# EasyEDA Pro project Master Design File.epro, board PCB1
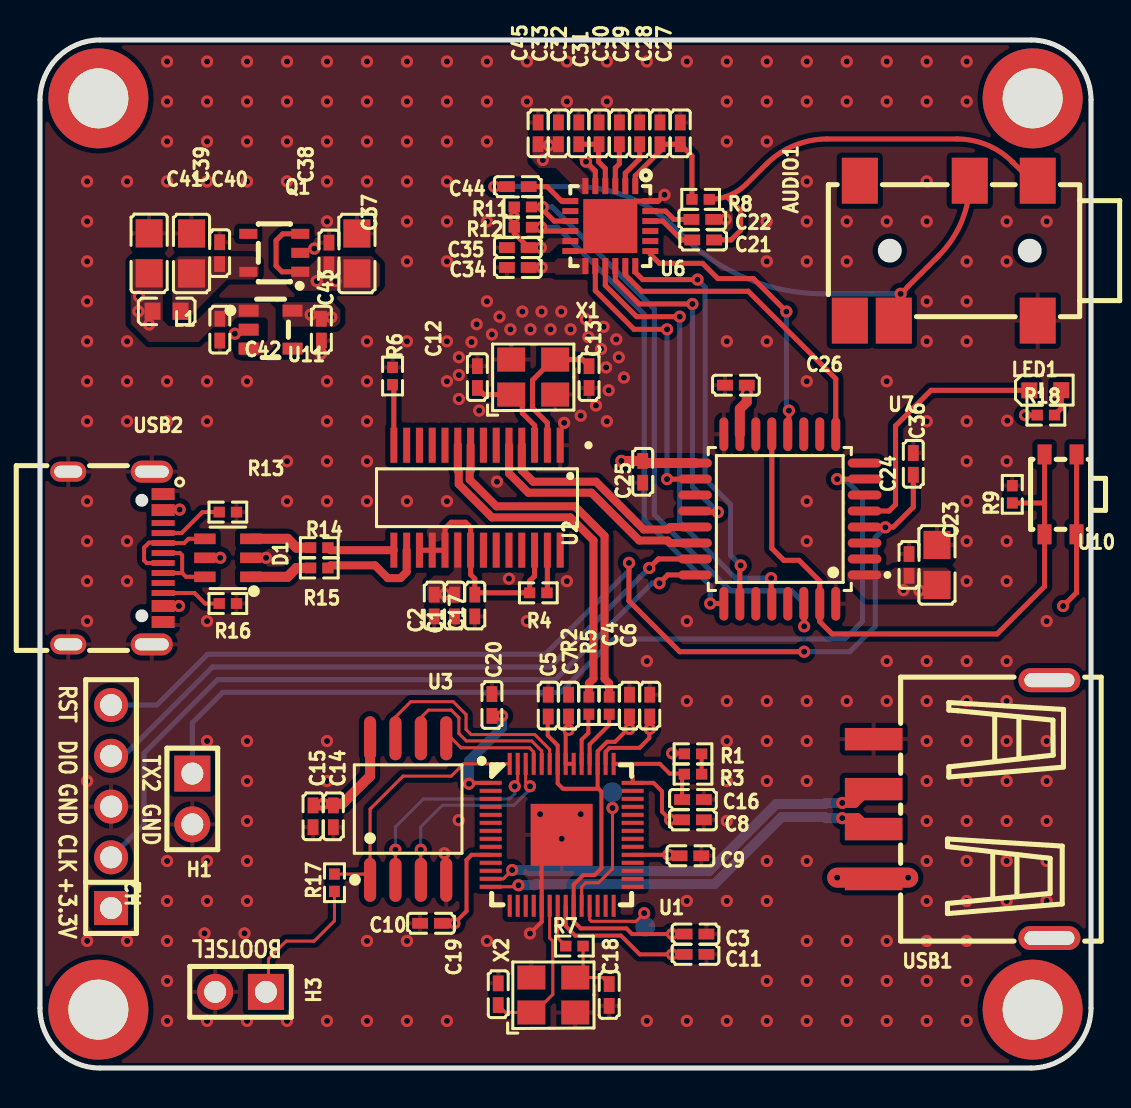
[diagram p2: board, top side]
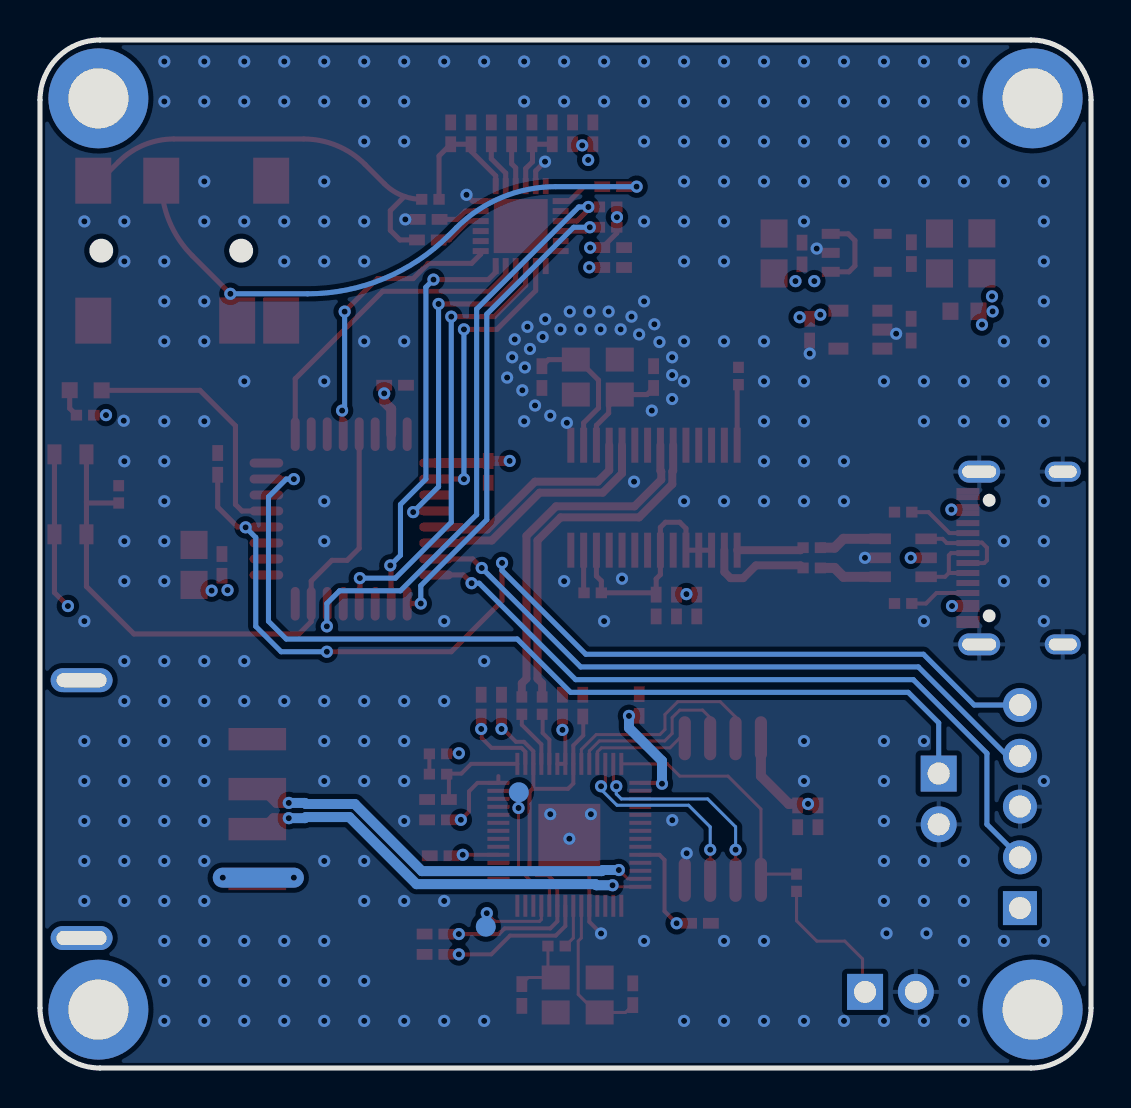
[diagram p3: board, bottom side, seen from below]

Outline 52.58 x 51.44 mm; copper layers: Top Layer, GND, PWR, Bottom Layer. Coordinates in mm from the lower left corner of the outline.
Outline path: 0,48.44 0,3 arc(0.88,0.88) 3,0 49.58,0 arc(51.7,0.88) 52.58,3 52.58,48.44 arc(51.7,50.56) 49.58,51.44 3,51.44 arc(0.88,50.56) 0,48.44
Stack: Top Layer 0.035mm Outer layer thickness 1oz / Dielectric1 0.2104mm 7628 RC49% 8.6mil / GND 0.0152mm Inner layer thickness / Dielectric2 1.065mm 1.1mm H/HOZ Copper / PWR 0.0152mm Inner layer thickness / Dielectric3 0.2104mm 7628 RC49% 8.6mil / Bottom Layer 0.035mm Outer layer thickness 1oz

## Design rules (mm)
template: Custom Config
spacing copperThickness1oz (default): track to track 0.102, other pairs 0.152 to 0.3
spacing copperThickness2oz: track to track 0.203, other pairs 0.152 to 0.3
track width copperThickness1oz (default): min 0.127, default 0.254, max 2.54
track width copperThickness2oz: min 0.203, default 0.254, max 2.54
differential pair differentialPair (default): width min 0.127, default 0.254, max 2.54; gap min 0.152, default 0.152
via viaSize (default): diameter min 0.5, default 0.61, max 10; hole min 0.3, default 0.305, max 6.3

## Placement (name value [footprint] x y rotation side)
AUDIO1  PJ-3420-A-SMT  [AUDIO-SMD_PJ-3420-A-SMT_C319102]  45.21 40.89 180 top
C1  100nF  [C0402]  20.74 23.14 90 top
C2  10uF  [C0402]  19.72 23.14 90 top
C3  100nF  [C0402]  32.79 6.7 180 top
C4  100nF  [C0402]  29.49 18.13 270 top
C5  2.2uF  [C0402]  25.43 18.13 270 top
C6  2.2uF  [C0402]  30.51 18.13 270 top
C7  100nF  [C0402]  26.44 18.13 270 top
C8  100nF  [C0402]  32.67 12.42 180 top
C9  100nF  [C0402]  32.54 10.62 180 top
C10  100nF  [C0402]  19.56 7.24 0 top
C11  100nF  [C0402]  32.79 5.69 180 top
C12  15pF  [C0402]  21.88 34.57 90 top
C13  15pF  [C0402]  27.47 34.57 90 top
C14  2.2uF  [C0402]  14.68 12.59 90 top
C15  100nF  [C0402]  13.66 12.59 90 top
C16  2.2uF  [C0402]  32.67 13.43 180 top
C17  10uF  [C0402]  21.75 23.14 90 top
C18  15pF  [C0402]  28.47 3.65 270 top
C19  15pF  [C0402]  22.92 3.69 270 top
C20  100nF  [C0402]  22.61 18.16 270 top
C21  1uF  [C0402]  33.17 41.43 0 top
C22  1uF  [C0402]  33.13 42.46 0 top
C23  10uF  [C0805]  44.87 25.17 270 top
C24  100nF  [C0402]  43.47 25.17 270 top
C25  100nF  [C0402]  30.15 29.83 90 top
C26  100nF  [C0402]  34.81 34.16 0 top
C27  1uF  [C0402]  32.03 46.76 270 top
C28  1uF  [C0402]  31.02 46.76 270 top
C29  1uF  [C0402]  30 46.76 270 top
C30  1uF  [C0402]  28.98 46.76 270 top
C31  1uF  [C0402]  27.97 46.76 270 top
C32  1uF  [C0402]  26.95 46.76 270 top
C33  100nF  [C0402]  25.94 46.76 270 top
C34  1uF  [C0402]  23.9 40.05 0 top
C35  1uF  [C0402]  23.9 41.05 0 top
C36  100nF  [C0402]  43.69 30.23 270 top
C37  10uF  [C0805]  15.85 40.75 270 top
C38  100nF  [C0402]  14.46 40.75 270 top
C39  100nF  [C0402]  8.99 40.77 270 top
C40  10uF  [C0805]  7.58 40.75 270 top
C41  10uF  [C0805]  5.46 40.76 270 top
C42  100nF  [C0402]  9 36.94 90 top
C43  100nF  [C0402]  14.08 36.94 90 top
C44  10uF  [C0402]  23.9 44.1 180 top
C45  10uF  [C0402]  24.92 46.76 270 top
D1  USBLC6-2SC6  [SOT-23-6_L2.9-W1.6-P0.95-LS2.8-BL]  9.4 25.53 90 top
H1  -  [HDR-TH_2P-P2.54-V-M-1]  7.62 13.46 270 top
H2  -  [HDR-TH_5P-P2.54-V-M]  3.56 13.08 90 top
H3  -  [HDR-TH_2P-P2.54-V-M-1]  10.03 3.81 180 top
L1  MPZ1608S101ATAH0  [L0603]  6.33 37.86 180 top
LED1  XL-1608UGC-04  [LED0603-RD_GREEN]  50.29 33.91 0 top
NOREF  -  [Pad_e84]  49.66 2.92 0 top
NOREF#2  -  [Pad_e86]  49.66 48.51 0 top
NOREF#3  -  [Pad_e89]  2.92 2.92 0 top
NOREF#4  -  [Pad_e90]  2.92 48.51 0 top
Q1  XC6220B331MR-G  [SOT-25_L3.0-W1.6-P0.95-LS2.8-TL]  11.72 40.78 180 top
R1  200Ω  [R0402]  32.67 15.72 0 top
R2  27Ω  [R0402]  27.46 18.13 90 top
R3  1Ω  [R0402]  32.67 14.7 0 top
R4  NC  [R0402]  24.93 23.77 0 top
R5  27Ω  [R0402]  28.47 18.13 90 top
R6  2.7kΩ  [R0402]  17.64 34.62 270 top
R7  1kΩ  [R0402]  26.73 6.1 180 top
R8  1.5kΩ  [R0402]  33.05 43.46 0 top
R9  1.5kΩ  [R0402]  48.64 28.7 90 top
R11  1.5kΩ  [R0402]  24.16 43.08 0 top
R12  1.5kΩ  [R0402]  24.16 42.06 0 top
R13  5.1kΩ  [R0402]  9.4 27.81 0 top
R14  0Ω  [R0402]  13.97 26.03 180 top
R15  0Ω  [R0402]  13.97 25.02 180 top
R16  5.1kΩ  [R0402]  9.4 23.24 0 top
R17  1kΩ  [R0402]  14.73 9.27 90 top
R18  150Ω  [R0402]  50.32 32.67 180 top
U1  RP2040  [LQFN-56_L7.0-W7.0-P0.4-EP]  26.1 11.67 0 top
U2  FE1.1S-BSOP28BCN  [SSOP-28_L9.9-W3.9-P0.64-LS6.0-BL-1]  21.86 28.53 180 top
U3  W25Q128JVSIQ  [SOP-8_L5.3-W5.3-P1.27-LS8.0-BL]  18.42 12.96 0 top
U4  -  [test pad 1]  28.63 13.8 180 bottom
U5  -  [test pad 1]  30.28 7.07 180 bottom
U6  MAX9860ETG+T  [TQFN-24_L4.0-W4.0-P0.50-BL-EP]  28.53 42.12 180 top
U7  STM32G431K6T6  [LQFP-32_L7.0-W7.0-P0.80-LS9.0-BL]  37.01 27.47 90 top
U10  TSC4A 160gf-WZ 016  [KEY-SMD_TSC4A]  51.05 28.7 90 top
U11  XC6220B181MR  [SOT-23-5_L2.9-W1.6-P0.95-LS2.8-BR]  11.54 36.94 180 top
USB1  10.0 QHHTZB6.3  [USB-A-TH_10.0QHHTZB6.3]  46.1 12.95 90 top
USB2  USB-310-B-SU  [USB-C-SMD_20P-P0.50-L7.4-W8.9]  3.79 25.52 90 top
X1  12MHz  [OSC-SMD_4P-L3.2-W2.5-BL]  24.67 34.57 0 top
X2  12MHz  [OSC-SMD_4P-L3.2-W2.5-BL]  25.68 3.65 0 top

## Footprints (pads in the part's own frame, mm; a bottom-side part is the same pattern mirrored in y, then rotated)
AUDIO-SMD_PJ-3420-A-SMT_C319102
  rect 1.8x2.3 smd: 1(-4.7,-3.5) 2(-4.7,3.5) 3(-1.3,-3.5) 4(2.5,3.5) 5(4.7,3.5) 6(4.2,-3.5)
C0402
  rect 0.79x0.54 smd: 1(-0.545,0) 2(0.545,0)
C0805
  rect 1.41x1.35 smd: 1(-1,0) 2(1,0)
HDR-TH_2P-P2.54-V-M-1
  rect 1.8x1.8 hole 1.1: 1(-1.27,0)
  round 1.8 hole 1.1: 2(1.27,0)
HDR-TH_5P-P2.54-V-M
  rect 1.7x1.7 hole 1.1: 1(-5.08,0)
  round 1.7 hole 1.1: 2(-2.54,0) 3(0,0) 4(2.54,0) 5(5.08,0)
KEY-SMD_TSC4A
  rect 1x0.7 smd: 1(-2,0.8) 2(2,0.8) 3(-2,-0.8) 4(2,-0.8)
L0603
  rect 0.8x0.864 smd: 1(-0.7,0) 2(0.7,0)
LED0603-RD_GREEN
  rect 0.8x0.8 smd: 1(-0.799,-0.004) 2(0.799,0.004)
LQFN-56_L7.0-W7.0-P0.4-EP
  rect 1.1x0.2 smd: 1(-3.55,2.6) 2(-3.55,2.2) 3(-3.55,1.8) 4(-3.55,1.4) 5(-3.55,1) 6(-3.55,0.6) 7(-3.55,0.2) 8(-3.55,-0.2) 9(-3.55,-0.6) 10(-3.55,-1) 11(-3.55,-1.4) 12(-3.55,-1.8) 13(-3.55,-2.2) 14(-3.55,-2.6) 29(3.55,-2.6) 30(3.55,-2.2) 31(3.55,-1.8) 32(3.55,-1.4) 33(3.55,-1) 34(3.55,-0.6) 35(3.55,-0.2) 36(3.55,0.2) 37(3.55,0.6) 38(3.55,1) 39(3.55,1.4) 40(3.55,1.8) 41(3.55,2.2) 42(3.55,2.6)
  rect 0.2x1.1 smd: 15(-2.6,-3.55) 16(-2.2,-3.55) 17(-1.8,-3.55) 18(-1.4,-3.55) 19(-1,-3.55) 20(-0.6,-3.55) 21(-0.2,-3.55) 22(0.2,-3.55) 23(0.6,-3.55) 24(1,-3.55) 25(1.4,-3.55) 26(1.8,-3.55) 27(2.2,-3.55) 28(2.6,-3.55) 43(2.6,3.55) 44(2.2,3.55) 45(1.8,3.55) 46(1.4,3.55) 47(1,3.55) 48(0.6,3.55) 49(0.2,3.55) 50(-0.2,3.55) 51(-0.6,3.55) 52(-1,3.55) 53(-1.4,3.55) 54(-1.8,3.55) 55(-2.2,3.55) 56(-2.6,3.55)
  rect 3.1x3.1 smd: 57(0,0)
LQFP-32_L7.0-W7.0-P0.80-LS9.0-BL
  oval 0.448x1.684 smd: 1(-2.8,-4.242) 2(-2,-4.242) 3(-1.2,-4.242) 4(-0.4,-4.242) 5(0.4,-4.242) 6(1.2,-4.242) 7(2,-4.242) 8(2.8,-4.242) 17(2.8,4.242) 18(2,4.242) 19(1.2,4.242) 20(0.4,4.242) 21(-0.4,4.242) 22(-1.2,4.242) 23(-2,4.242) 24(-2.8,4.242)
  oval 1.684x0.448 smd: 9(4.242,-2.8) 10(4.242,-2) 11(4.242,-1.2) 12(4.242,-0.4) 13(4.242,0.4) 14(4.242,1.2) 15(4.242,2) 16(4.242,2.8) 25(-4.242,2.8) 26(-4.242,2) 27(-4.242,1.2) 28(-4.242,0.4) 29(-4.242,-0.4) 30(-4.242,-1.2) 31(-4.242,-2) 32(-4.242,-2.8)
OSC-SMD_4P-L3.2-W2.5-BL
  rect 1.4x1.2 smd: 1(-1.1,-0.875) 2(1.1,-0.875) 3(1.1,0.875) 4(-1.1,0.875)
Pad_e84
  round 5 hole 3: 1(0,0)
Pad_e86
  round 5 hole 3: 1(0,0)
Pad_e89
  round 5 hole 3: 1(0,0)
Pad_e90
  round 5 hole 3: 1(0,0)
R0402
  rect 0.566x0.54 smd: 1(-0.433,0) 2(0.433,0)
SOP-8_L5.3-W5.3-P1.27-LS8.0-BL
  oval 0.609x2.204 smd: 1(-1.905,-3.542) 2(-0.635,-3.542) 3(0.635,-3.542) 4(1.905,-3.542) 5(1.905,3.542) 6(0.635,3.542) 7(-0.635,3.542) 8(-1.905,3.542)
SOT-23-5_L2.9-W1.6-P0.95-LS2.8-BR
  rect 1x0.6 smd: 1(1.1,-0.95) 2(1.1,0) 3(1.1,0.95) 4(-1.1,0.95) 5(-1.1,-0.95)
SOT-23-6_L2.9-W1.6-P0.95-LS2.8-BL
  rect 0.532x1.072 smd: 1(-0.95,-1.149) 2(0,-1.149) 3(0.95,-1.149) 4(0.95,1.149) 5(0,1.149) 6(-0.95,1.149)
SOT-25_L3.0-W1.6-P0.95-LS2.8-TL
  rect 0.9x0.5 smd: 1(-1.3,0.95) 2(-1.3,0) 3(-1.3,-0.95) 4(1.3,-0.95) 5(1.3,0.95)
SSOP-28_L9.9-W3.9-P0.64-LS6.0-BL-1
  rect 0.35x1.751 smd: 1(-4.16,-2.626) 2(-3.52,-2.626) 3(-2.88,-2.626) 4(-2.24,-2.626) 5(-1.6,-2.626) 6(-0.96,-2.626) 7(-0.32,-2.626) 8(0.32,-2.626) 9(0.96,-2.626) 10(1.6,-2.626) 11(2.24,-2.626) 12(2.88,-2.626) 13(3.52,-2.626) 14(4.16,-2.626) 15(4.16,2.626) 16(3.52,2.626) 17(2.88,2.626) 18(2.24,2.626) 19(1.6,2.626) 20(0.96,2.626) 21(0.32,2.626) 22(-0.32,2.626) 23(-0.96,2.626) 24(-1.6,2.626) 25(-2.24,2.626) 26(-2.88,2.626) 27(-3.52,2.626) 28(-4.16,2.626)
test pad 1
  round 1 smd: 1(0,0)
TQFN-24_L4.0-W4.0-P0.50-BL-EP
  rect 0.3x0.8 smd: 1(-1.25,-2) 2(-0.75,-2) 3(-0.25,-2) 4(0.25,-2) 5(0.75,-2) 6(1.25,-2) 13(1.25,2) 14(0.75,2) 15(0.25,2) 16(-0.25,2) 17(-0.75,2) 18(-1.25,2)
  rect 0.8x0.3 smd: 7(2,-1.25) 8(2,-0.75) 9(2,-0.25) 10(2,0.25) 11(2,0.75) 12(2,1.25) 19(-2,1.25) 20(-2,0.75) 21(-2,0.25) 22(-2,-0.25) 23(-2,-0.75) 24(-2,-1.25)
  rect 2.7x2.7 smd: 25(0,0)
USB-A-TH_10.0QHHTZB6.3
  rect 1.12x2.88 smd: 1(-3.5,4.395) 2(-1,4.395) 3(1,4.395) 4(3.5,4.395)
  oval 1.2x3.1 hole 0.7x2.5: 5(-6.45,-4.395) 6(6.45,-4.395)
USB-C-SMD_20P-P0.50-L7.4-W8.9
  oval 1x1.8 hole 0.6x1.4: 0(-4.32,2.373) 0(4.32,2.373)
  oval 1.1x2.1 hole 0.6x1.7: 0(-4.32,-1.807) 0(4.32,-1.807)
  rect 0.3x1.15 smd: A1(3.35,-2.372) A4(2.55,-2.372) A5(1.25,-2.373) A6(0.249,-2.373) A7(-0.25,-2.372) A8(-1.25,-2.373) A9(-2.55,-2.373) A12(-3.35,-2.373) B1(-3.05,-2.373) B4(-2.251,-2.373) B5(-1.75,-2.373) B6(-0.75,-2.373) B7(0.75,-2.372) B8(1.75,-2.373) B9(2.251,-2.372) B12(3.05,-2.372)

## Nets
As in the schematic.

Pads without a net: AUDIO1 5 6; NOREF 1; NOREF#2 1; NOREF#3 1; NOREF#4 1; Q1 4; U1 8 26 41; U2 6 7 10 11 12 13 22 23 24 25 28; U6 8 20 21; U7 2 3; U11 4; USB1 5 6; USB2 A8 B8

## Via types
v1: diameter 0.61, hole 0.305, Top Layer to Bottom Layer, 350 vias

## Routing (per net, layer and track width the routed paths; a pad name or vN(x,y) marks a point on that pad's centre or on a via; arc(x,y) is an arc through that point)
+1.8V: length 20.7
  PWR w1: v1(25.45,46.16) 25.45,45.73 v1(25.15,45.43) 25.56,45.43 26.67,44.32 26.67,40.89 25.83,40.06 v1(25.1,40.06) 21.9,40.06 19.53,37.69 v1(13.54,37.69)
  vias: v1(14.58,37.56)
+3.3V: length 54
  Top Layer w0.2: U1.10 21.59,10.67 21.34,10.41 21.34,7.85 v1(20.73,7.24) ; U1.33 v1(31.43,10.67) 31.95,10.67 C9.2 ; R1.1 32.2,15.75 v1(31.62,15.75) ; C7.2 v1(26.44,16.92) 26.3,16.77 U1.49 U1.48 ; U1.1 21.51,14.27 v1(21.46,14.22) ; v1(31.62,5.69) 30,5.69 29.06,6.62 26.78,6.62 26.3,7.1 U1.22 ; C6.2 30.48,17.56 30.48,16.51 29.99,16.02 28.49,16.02 28.3,15.82 U1.44 ; 29.65,14.6 U1.42 30.69,14.27 31.11,13.84 31.11,12.83 v1(31.52,12.42) C8.2
  Top Layer w0.254: v1(51.18,23.11) 51.85,23.79 U10.3 U10.4 ; R18.2 v1(49.28,32.67) ; C35.2 23.72,41.77 R12.1 R11.1
  Top Layer w0.5: U3.8 16.51,14.61 15.12,13.21 v1(14.16,13.21) 14.08,13.14 C15.2 ; 22.61,17.62 v1(23.11,17.62) ; C26.2 v1(35.36,33.75) 35.36,33.33 35.01,32.98 U7.15 ; v1(29.08,30.37) C25.2 30.26,30.27 U7.17
  Bottom Layer w0.5: v1(23.11,17.62) 23.11,17.02 21.46,15.37 v1(21.46,14.22)
  vias: v1(4.95,38.61) v1(4.92,37.85) v1(5.45,37.19) v1(23.72,42.57) v1(25.06,41.04) v1(30.51,16.96) v1(43.2,23.91) v1(43.99,23.88)
GND: length 12.9
  Top Layer w0.2: v1(24.51,6.73) 25.1,7.32 U1.19 25.1,10.67 U1.57
  Top Layer w0.254: v1(27.31,45.35) 27.78,44.88 U6.5 ; U6.12 27.28,40.87 U6.25 29.78,43.37 U6.24 30.93,43.37 v1(31.24,43.69)
  vias: v1(2.36,44.36) v1(2.36,42.36) v1(2.36,40.36) v1(2.36,38.36) v1(2.36,36.36) v1(2.36,34.36) v1(2.36,32.36) v1(2.36,28.36) v1(2.36,26.36) v1(2.36,24.36) v1(2.36,22.36) v1(2.36,14.36) v1(2.36,6.36) v1(4.36,44.36) v1(4.36,36.36) v1(4.36,34.36) v1(4.36,32.36) v1(4.36,26.36) v1(4.36,24.36) v1(4.36,6.36) v1(6.36,50.36) v1(6.36,48.36) v1(6.36,46.36) v1(6.36,44.36) v1(6.36,34.36) v1(6.36,32.36) v1(6.36,10.36) v1(6.36,8.36) v1(6.36,6.36) v1(6.36,4.36) v1(6.36,2.36) v1(8.23,6.74) v1(8.36,50.36) v1(8.36,48.36) v1(8.36,46.36) v1(8.36,44.36) v1(8.36,34.36) v1(8.36,32.36) v1(8.36,22.36) v1(8.36,16.36) v1(8.36,10.36) v1(8.36,8.36) v1(8.36,2.36) v1(9.75,36.74) v1(10.23,6.74) v1(10.36,50.36) v1(10.36,48.36) v1(10.36,46.36) v1(10.36,44.36) v1(10.36,34.36) v1(10.36,16.36) v1(10.36,14.36) v1(10.36,12.36) v1(10.36,10.36) v1(10.36,8.36) v1(10.36,2.36) v1(11.31,25.53) v1(12.36,50.36) v1(12.36,48.36) v1(12.36,46.36) v1(12.36,44.36) v1(12.36,30.36) v1(12.36,28.36) v1(12.36,2.36) v1(13.72,41) v1(14.07,35.75) v1(14.36,50.36) v1(14.36,48.36) v1(14.36,46.36) v1(14.36,44.36) v1(14.36,42.36) v1(14.36,34.36) v1(14.36,32.36) v1(14.36,30.36) v1(14.36,28.36) v1(14.36,16.36) v1(14.36,14.36) v1(14.36,2.36) v1(16.36,50.36) v1(16.36,48.36) v1(16.36,46.36) v1(16.36,44.36) v1(16.36,36.36) v1(16.36,34.36) v1(16.36,32.36) v1(16.36,30.36) v1(16.36,28.36) v1(16.36,6.36) v1(16.36,2.36) v1(18.36,50.36) v1(18.36,48.36) v1(18.36,46.36) v1(18.36,44.36) v1(18.36,42.36) v1(18.36,40.36) v1(18.36,36.36) v1(18.36,28.36) v1(18.36,6.36) v1(18.36,2.36) v1(20.23,10.74) v1(20.36,50.36) v1(20.36,48.36) v1(20.36,46.36) v1(20.36,44.36) v1(20.36,42.36) v1(20.36,40.36) v1(20.36,36.36) v1(20.36,34.36) v1(20.36,28.36) v1(20.36,2.36) v1(20.95,35.56) v1(20.95,34.67) v1(20.95,33.47) v1(20.95,12.4) v1(21.59,36.32) v1(21.84,37.21) v1(21.97,32.89) v1(22.36,50.36) v1(22.36,48.36) v1(22.36,46.36) v1(22.36,42.36) v1(22.36,38.36) v1(22.36,6.36) v1(22.61,36.7) v1(22.86,29.34) v1(22.99,37.59) v1(23.46,24.48) v1(23.53,36.96) v1(24.13,37.85) v1(24.36,50.36) v1(24.36,48.36) v1(24.36,22.36) v1(24.54,36.96) v1(25.02,12.7) v1(25.09,37.85) v1(25.54,36.96) v1(26.08,37.85) v1(26.1,11.47) v1(26.22,32.28) v1(26.36,50.36) v1(26.36,48.36) v1(26.36,24.36) v1(26.54,36.96) v1(27.05,32.64) v1(27.05,12.7) v1(27.3,37.46) v1(27.43,36.58) v1(27.81,33.15) v1(28.07,35.98) v1(28.19,37.08) v1(28.36,50.36) v1(28.36,48.36) v1(28.32,35.05) v1(28.36,32.36) v1(28.45,33.91) v1(28.83,36.46) v1(28.96,35.56) v1(29.21,34.54) v1(30.36,50.36) v1(30.36,20.36) v1(30.36,2.36) v1(32.36,50.36) v1(32.36,22.36) v1(32.36,18.36) v1(32.36,8.36) v1(32.36,2.36) v1(34.36,50.36) v1(34.36,48.36) v1(34.36,46.36) v1(34.3,42.46) v1(34.36,36.36) v1(34.36,18.36) v1(34.36,16.36) v1(34.36,14.36) v1(34.36,12.36) v1(34.36,8.36) v1(34.36,2.36) v1(36.36,50.36) v1(36.36,48.36) v1(36.36,46.36) v1(36.36,42.36) v1(36.36,40.36) v1(36.36,36.36) v1(36.36,18.36) v1(36.36,16.36) v1(36.36,14.36) v1(36.36,10.36) v1(36.36,8.36) v1(36.36,4.36) v1(36.36,2.36) v1(38.36,50.36) v1(38.36,48.36) v1(38.36,44.36) v1(38.36,42.36) v1(38.36,40.36) v1(38.36,34.36) v1(38.36,28.36) v1(38.36,26.36) v1(38.36,18.36) v1(38.36,16.36) v1(38.36,14.36) v1(38.36,10.36) v1(38.36,6.36) v1(38.36,4.36) v1(38.36,2.36) v1(40.36,50.36) v1(40.36,48.36) v1(40.36,42.36) v1(40.36,40.36) v1(40.36,18.36) v1(40.36,6.36) v1(40.36,4.36) v1(40.36,2.36) v1(42.36,50.36) v1(42.36,48.36) v1(42.36,42.36) v1(42.36,34.36) v1(42.36,20.36) v1(42.36,18.36) v1(42.36,6.36) v1(42.36,4.36) v1(42.36,2.36) v1(44.36,50.36) v1(44.36,48.36) v1(44.36,44.36) v1(44.36,42.36) v1(44.36,38.36) v1(44.36,36.36) v1(44.36,32.36) v1(44.36,20.36) v1(44.36,18.36) v1(44.36,16.36) v1(44.36,14.36) v1(44.36,12.36) v1(44.36,10.36) v1(44.36,8.36) v1(44.36,6.36) v1(44.36,4.36) v1(44.36,2.36) v1(46.36,50.36) v1(46.36,48.36) v1(46.36,40.36) v1(46.36,38.36) v1(46.36,36.36) v1(46.36,32.36) v1(46.36,30.36) v1(46.36,28.36) v1(46.36,26.36) v1(46.36,24.36) v1(46.36,20.36) v1(46.36,18.36) v1(46.36,16.36) v1(46.36,14.36) v1(46.36,12.36) v1(46.36,10.36) v1(46.36,8.36) v1(46.36,6.36) v1(46.36,4.36) v1(46.36,2.36) v1(48.36,42.36) v1(48.36,40.36) v1(48.36,30.36) v1(48.36,26.36) v1(48.36,24.36) v1(48.36,20.36) v1(48.36,18.36) v1(48.36,16.36) v1(48.36,14.36) v1(48.36,12.36) v1(48.36,10.36) v1(48.36,8.36) v1(48.39,32.38) v1(50.36,42.36) v1(50.36,22.36) v1(50.36,16.36) v1(50.36,14.36) v1(50.36,12.36) v1(50.36,10.36) v1(50.36,8.36)
VBUS: length 97.3
  Top Layer w0.254: Q1.1 12.11,39.84 11.81,40.13 11.81,41.4 12.14,41.73 Q1.3
  Top Layer w1: v1(39.88,9.52) v1(43.43,9.52)
  PWR w1: v1(14.79,39.37) v1(13.84,39.37) 13.08,39.37 11.56,37.85 11.56,32.51 v1(6.98,27.94) 6.95,27.91 v1(6.95,23.12)
  PWR w1.2: 11.56,22.99 19.52,22.99 v1(20.24,23.71) ; 11.56,22.99 11.56,7.11 14.35,4.32 34.54,4.32 39.75,9.52 v1(43.43,9.52) ; 11.56,22.99 v1(9.02,25.53) 7.02,25.53 6.95,25.6
  Bottom Layer w1: v1(43.43,9.52) v1(39.88,9.52)
ADC: length 1
  Top Layer w0.2: R1.2 R3.2
BOOT: length 13.4
  Top Layer w0.152: U1.56 21.19,15.22 20.57,14.6 18.16,14.6 16.51,12.96 U3.1 16.22,9.7 R17.2
D+: length 5.5
  Top Layer w0.4: R15.1 14.53,25.15 16.76,25.15 17.4,24.51 18.03,24.51 18.34,24.82 U2.16
D-: length 3.4
  Top Layer w0.4: R14.1 14.53,25.91 U2.15
IO10: length 21.1
  Top Layer w0.152: v1(23.62,9.91) 23.18,9.47 U1.13
  Top Layer w0.5: v1(40.13,13.26) 40.74,13.26 41.44,13.95 USB1.3
  Bottom Layer w0.5: v1(23.62,9.91) 24.42,9.91 24.48,9.85 33.47,9.85 36.83,13.21 39.27,13.21 39.33,13.26 v1(40.13,13.26)
IO11: length 20.9
  Top Layer w0.152: v1(23.94,9.14) 23.86,9.07 U1.14
  Top Layer w0.5: USB1.2 41.44,11.95 40.89,12.5 v1(40.13,12.5)
  Bottom Layer w0.5: v1(23.94,9.14) 24.74,9.14 24.8,9.2 33.74,9.2 37.1,12.56 39.27,12.56 39.33,12.5 v1(40.13,12.5)
NRST: length 54.5
  Top Layer w0.254: v1(38.23,20.83) 32,20.83 29.46,23.37 v1(29.46,25.27) ; U7.4 42.69,27.07 43.69,28.07 C36.2
  Bottom Layer w0.254: H2.5 5.84,18.16 8.38,20.7 25.27,20.7 29.46,24.89 v1(29.46,25.27) ; v1(42.29,27.05) 41.78,26.54 41.78,22.1 40.51,20.83 v1(38.23,20.83)
PA0: length 13
  Top Layer w0.254: LED1.1 44.57,33.91 42.8,32.13 42.8,28.19 42.47,27.87 U7.5
PA2: length 47.4
  Top Layer w0.254: v1(39.88,29.46) 41.25,29.46 U7.7
  Bottom Layer w0.254: 7.62,14.73 7.62,17.27 9.14,18.8 26.04,18.8 28.7,21.46 40.26,21.46 41.15,22.35 41.15,28.57 40.26,29.46 v1(39.88,29.46)
PA4: length 15.9
  Top Layer w0.254: U7.9 39.81,34.49 35.43,38.86 30.1,38.86 29.28,39.68 U6.17
PA7: length 14.4
  Top Layer w0.254: U7.12 37.46,31.77 v1(37.46,32.89) ; v1(37.34,37.85) 35.69,39.5 33.91,39.5 33.15,40.26 30.99,40.26 30.53,40.72 U6.19
  Bottom Layer w0.254: v1(37.46,32.89) 37.34,33.02 v1(37.34,37.85)
PA8: length 14.5
  Top Layer w0.254: v1(31.37,36.96) 29.72,36.96 27.78,38.89 U6.14 ; v1(31.37,29.46) 32.76,29.46 U7.18
  Bottom Layer w0.254: v1(31.37,36.96) v1(31.37,29.46)
PA10: length 17.2
  Top Layer w0.254: U6.16 28.78,39.42 29.97,38.23 v1(32.64,38.23) ; v1(33.91,27.81) 32.82,27.81 U7.20
  Bottom Layer w0.254: v1(32.64,38.23) 32.64,29.08 v1(33.91,27.81)
PA11: length 11.2
  Top Layer w0.4: 24.1,31.16 24.1,29.91 24.67,29.34 27.81,29.34 30.2,26.94 31.4,26.94 31.53,27.07 U7.21
PA12: length 12.2
  Top Layer w0.4: U7.22 31.53,26.27 31.4,26.39 29.98,26.39 27.58,28.78 24.43,28.78 23.46,29.75 U2.5
PA13: length 33.3
  Top Layer w0.254: U7.23 30.93,25.47 v1(30.48,25.02)
  Bottom Layer w0.254: H2.4 4.19,15.62 8.64,20.07 25.53,20.07 v1(30.48,25.02)
PA14: length 37.1
  Top Layer w0.254: U7.24 31.4,24.67 v1(30.99,24.26)
  Bottom Layer w0.254: v1(30.99,24.26) 30.61,24.26 25.78,19.43 8.89,19.43 5.21,15.75 5.21,12.19 H2.2
PA15: length 25.5
  Top Layer w0.254: 24.59,42.06 v1(25.07,42.06) 25.26,41.87 U6.10 ; v1(33.53,23.24) 34.2,23.24 U7.25
  Bottom Layer w0.254: v1(33.53,23.24) 33.53,24.13 30.23,27.43 30.23,37.72 25.88,42.06 v1(25.07,42.06)
PB3: length 20.7
  Top Layer w0.254: v1(32.89,39.45) 30.15,39.45 29.78,39.81 U6.18 ; v1(35.05,25.15) 35.01,25.1 U7.26
  Bottom Layer w0.254: v1(35.05,25.15) 34.54,25.65 34.54,28.19 33.27,29.46 33.27,39.06 v1(32.89,39.45)
PB5: length 22.7
  Top Layer w0.254: v1(36.58,24.51) 36.58,23.26 U7.28 ; v1(32,37.59) 29.85,37.59 28.28,39.16 U6.15
  Bottom Layer w0.254: v1(36.58,24.51) 34.8,24.51 32,27.3 v1(32,37.59)
PB7: length 31.9
  Top Layer w0.254: U6.9 25.73,42.37 25.15,42.95 v1(25.15,43.08) 24.59,43.08 ; U7.30 38.23,23.21 v1(38.23,22.1)
  Bottom Layer w0.254: v1(25.15,43.08) 25.63,43.08 30.73,37.97 30.73,27.69 34.54,23.88 37.59,23.88 38.23,23.24 v1(38.23,22.1)
RP_D+: length 17.8
  Top Layer w0.4: U2.9 20.9,29.88 20.95,29.84 20.95,29.21 22.61,27.55 26.53,27.55 27.69,26.39 27.69,19.48 27.46,19.25 R2.2
RP_D-: length 17.8
  Top Layer w0.4: R5.2 28.47,19.25 28.24,19.48 28.24,26.62 26.76,28.1 22.84,28.1 21.5,29.44 21.5,29.84 21.54,29.88 21.54,31.16
$1N1326: length 7
  Top Layer w0.254: 25.38,31.16 25.38,32.28 24.64,33.02 24.64,34.42 25.67,35.44 X1.3 27.14,35.44 C13.2
$1N1327: length 4.8
  Top Layer w0.254: C12.1 22.21,33.69 X1.1 24.13,33.14 24.13,32.77 24.74,32.15 U2.3
$1N1330: length 3.1
  Top Layer w0.254: R6.2 17.7,34.12 U2.14
$1N1333: length 12.3
  Top Layer w0.254: U2.26 24.74,24.61 24.5,24.37 R4.1 21.84,23.77 C17.2 21.75,24.47 21.54,24.69 21.54,27.05 21.29,27.3 20.57,27.3 20.26,26.99 20.26,25.91 U2.18 U2.17
$1N1341: length 2.1
  Top Layer w0.254: R4.2 25.38,23.8 25.38,25.91
$1N2819: length 10.3
  Top Layer w0.152: U3.3 19.05,9.42 v1(19.05,10.92) ; v1(24.51,14.1) 24.3,14.31 U1.54
  Bottom Layer w0.152: v1(24.51,14.1) 24.51,13.94 23.71,13.15 20.13,13.15 19.05,12.06 v1(19.05,10.92)
$1N2820: length 10.9
  Top Layer w0.152: U3.2 17.78,9.42 v1(17.78,10.92) ; U1.55 23.9,14.24 v1(23.75,14.1)
  Bottom Layer w0.152: v1(17.78,10.92) 17.78,12.06 19.18,13.46 23.49,13.46 23.75,13.72 v1(23.75,14.1)
$1N2821: length 5.3
  Top Layer w0.152: U1.53 24.7,15.82 24.49,16.02 21.06,16.02 20.59,16.5 U3.5
$1N2822: length 9.2
  Top Layer w0.152: U1.52 25.1,15.86 24.6,16.36 21.33,16.36 20.95,16.74 20.95,17.53 20.57,17.91 19.43,17.91 19.05,17.53 U3.6
$1N2823: length 11.2
  Top Layer w0.152: U3.7 17.78,17.56 18.55,18.33 20.67,18.33 21.31,17.69 21.31,16.94 21.57,16.68 24.75,16.68 25.5,15.94 U1.51
$1N2826: length 2.2
  Top Layer w0.152: 26.3,6.1 25.9,6.51 U1.21
$1N2831: length 2.6
  Top Layer w0.2: R2.1 27.43,17.67 27.43,16.76 27.1,16.43 U1.47
$1N2832: length 2.9
  Top Layer w0.2: U1.46 27.5,16.19 28.47,17.17 R5.1
$1N2835: length 5.9
  Top Layer w0.152: v1(28.64,13.01) 28.64,9.97 27.94,9.27 27.3,9.27 27.1,9.06 U1.24
$1N2836: length 3.6
  Top Layer w0.152: v1(30.23,7.75) 29.82,7.34 27.59,7.34 27.5,7.43 U1.25
$1N2868: length 5.1
  Top Layer w0.2: U1.43 31.01,15.22 31.5,14.73 32.2,14.73 R3.1 32.12,14.59 C16.2
$1N2869: length 23
  Top Layer w0.2: C4.2 29.49,17.04 28.77,16.32 28.37,16.32 27.9,15.85 U1.45 27.9,14.01 27.94,13.97 ; 27.94,13.97 26.16,13.97 25.9,14.23 U1.50 25.9,16.14 25.4,16.64 25.4,17.56 C5.2 ; 27.94,13.97 28.08,13.83 28.08,9.99 27.74,9.65 27.18,9.65 26.7,9.17 U1.23 26.7,7.34 27.05,6.98 29.34,6.98 29.62,6.7 v1(31.62,6.7)
  vias: v1(29.49,16.96)
$1N2871: length 7.8
  Top Layer w0.152: C19.2 23.29,2.78 X2.1 24.75,2.78 25.65,3.68 25.65,6.35 25.5,6.51 U1.20
$1N2872: length 3.6
  Top Layer w0.152: C18.1 28.14,4.53 X2.3 27.17,4.92 R7.1
$1N8823: length 3
  Top Layer w0.2: R16.1 8.25,23.24 7.73,23.77 USB2.B5
$1N8824: length 4.1
  Top Layer w0.2: USB2.B6 7.11,24.77 7.3,24.58 D1.6 ; USB2.A6 7,25.77 7.11,25.65 7.11,24.77
$1N8825: length 4.9
  Top Layer w0.2: USB2.A7 5.34,25.27 5.21,25.4 5.21,26.03 5.46,26.29 6.13,26.29 USB2.B7 7.22,26.27 7.43,26.48 D1.4
$1N8826: length 3.2
  Top Layer w0.2: R13.1 8.13,27.81 7.08,26.77 USB2.A5
$1N8828: length 3.2
  Top Layer w0.5: D1.3 12.39,26.48 12.83,26.03 R14.2
$1N8829: length 3.2
  Top Layer w0.5: D1.1 12.39,24.58 12.83,25.02 R15.2
$1N10211: length 3.3
  Top Layer w0.254: C32.2 C31.2 27.94,46.19 27.94,45.34 28.28,45 U6.4
$1N10390: length 6.6
  Top Layer w0.254: R8.1 32.61,45.63 C27.2 C28.2 31.02,45.87 29.78,44.64 U6.1
$1N10572: length 2.4
  Top Layer w0.254: C29.2 30,45.49 29.28,44.77 U6.2
$1N10576: length 2.2
  Top Layer w0.254: U6.3 28.78,45.04 28.98,45.24 C30.2
$1N10655: length 2.2
  Top Layer w0.254: C22.1 31.71,42.46 31.29,42.87 U6.23
$1N10660: length 2.5
  Top Layer w0.254: C21.1 32.1,41.43 31.16,42.37 U6.22
$1N10709: length 21.6
  Top Layer w0.254: 34.34,43.61 35.05,42.9 35.05,41.91 34.57,41.43 C21.2 ; 34.34,43.61 arc(33.92,43.5) R8.2 ; 34.34,43.61 arc(34.88,43.86) 35.34,44.23 36.32,45.21 arc(37.73,46.15) 39.39,46.48 45.88,46.48 arc(47.37,46.18) 48.64,45.34 49.36,44.62 arc(49.61,44.45) AUDIO1.1
$1N10766: length 2.4
  Top Layer w0.254: U6.7 26.1,43.37 25.37,44.1 C44.1
$1N10774: length 30.7
  Top Layer w0.254: C44.2 v1(22.73,44.1) ; AUDIO1.4 arc(42.81,38.08) 43.1,38.7 arc(43.25,38.91) 43.42,39.1 44.96,40.64 arc(46.11,42.36) 46.51,44.39
  Bottom Layer w0.254: v1(22.73,44.1) 26.78,44.1 arc(29.47,43.56) 31.75,42.04 32.12,41.66 arc(35.37,39.5) 39.19,38.73 v1(43.05,38.73)
$1N11459: length 31.5
  Top Layer w0.254: R9.1 50.22,28.27 50.25,28.3 ; 50.25,28.3 U10.1 50.25,24.09 47.88,21.72 39.62,21.72 39.01,22.33 U7.31 39.01,24.36 37.97,25.4 37.21,25.4 36.61,26 U7.13 ; 50.25,28.3 U10.2
$1N27069: length 7.3
  Top Layer w0.152: R17.1 14.73,7.37 13.72,6.35 12.32,6.35 11.43,5.46 11.43,3.94 H3.1
$1N27660: length 1.4
  Top Layer w0.254: R18.1 51.09,33 LED1.2

## Copper pours and planes (outline as drawn; the poured copper is in the pictures)
+1.8V on Top Layer: 24.64,46.62 27.43,46.62 27.43,43.72 24.64,43.72
+1.8V on Top Layer: 12.13,38.31 15.02,38.31 15.02,37.09 12.13,37.09
+1.8V on Top Layer: 24.05,40.51 27.45,40.51 27.45,39.69 24.05,39.69
+3.3V on Top Layer: 4.54,40.47 11.79,40.47 11.79,35.64 4.54,35.64
+3.3V on Top Layer: 24.04,41.52 26.93,41.52 26.93,40.77 24.04,40.77
+3.3V on Top Layer: 40.39,25.04 45.57,25.04 45.57,23.45 40.39,23.45
+3.3V on PWR: 0,48.44 0.01,48.7 0.06,49.04 0.15,49.38 0.28,49.7 0.45,50.01 0.65,50.3 0.88,50.56 1.14,50.79 1.43,50.99 1.73,51.15 2.06,51.28 2.39,51.37 2.74,51.42 3,51.44 49.58,51.44 49.84,51.42 50.18,51.37 50.52,51.28 50.85,51.15 51.15,50.99 51.44,50.79 51.7,50.56 51.93,50.3 52.13,50.01 52.3,49.7 52.43,49.38 52.52,49.04 52.57,48.7 52.58,48.44 52.58,3 52.57,2.74 52.52,2.39 52.43,2.06 52.3,1.73 52.13,1.43 51.93,1.14 51.7,0.88 51.44,0.65 51.15,0.45 50.85,0.28 50.52,0.15 50.18,0.06 49.84,0.01 49.58,0 3,0 2.74,0.01 2.39,0.06 2.06,0.15 1.73,0.28 1.43,0.45 1.14,0.65 0.88,0.88 0.65,1.14 0.45,1.43 0.28,1.73 0.15,2.06 0.06,2.39 0.01,2.74 0,3
GND on Top Layer: 0,48.44 0.01,48.7 0.06,49.04 0.15,49.38 0.28,49.7 0.45,50.01 0.65,50.3 0.88,50.56 1.14,50.79 1.43,50.99 1.73,51.15 2.06,51.28 2.39,51.37 2.74,51.42 3,51.44 49.58,51.44 49.84,51.42 50.18,51.37 50.52,51.28 50.85,51.15 51.15,50.99 51.44,50.79 51.7,50.56 51.93,50.3 52.13,50.01 52.3,49.7 52.43,49.38 52.52,49.04 52.57,48.7 52.58,48.44 52.58,3 52.57,2.74 52.52,2.39 52.43,2.06 52.3,1.73 52.13,1.43 51.93,1.14 51.7,0.88 51.44,0.65 51.15,0.45 50.85,0.28 50.52,0.15 50.18,0.06 49.84,0.01 49.58,0 3,0 2.74,0.01 2.39,0.06 2.06,0.15 1.73,0.28 1.43,0.45 1.14,0.65 0.88,0.88 0.65,1.14 0.45,1.43 0.28,1.73 0.15,2.06 0.06,2.39 0.01,2.74 0,3
GND on Bottom Layer: 0,48.44 0.01,48.7 0.06,49.04 0.15,49.38 0.28,49.7 0.45,50.01 0.65,50.3 0.88,50.56 1.14,50.79 1.43,50.99 1.73,51.15 2.06,51.28 2.39,51.37 2.74,51.42 3,51.44 49.58,51.44 49.84,51.42 50.18,51.37 50.52,51.28 50.85,51.15 51.15,50.99 51.44,50.79 51.7,50.56 51.93,50.3 52.13,50.01 52.3,49.7 52.43,49.38 52.52,49.04 52.57,48.7 52.58,48.44 52.58,3 52.57,2.74 52.52,2.39 52.43,2.06 52.3,1.73 52.13,1.43 51.93,1.14 51.7,0.88 51.44,0.65 51.15,0.45 50.85,0.28 50.52,0.15 50.18,0.06 49.84,0.01 49.58,0 3,0 2.74,0.01 2.39,0.06 2.06,0.15 1.73,0.28 1.43,0.45 1.14,0.65 0.88,0.88 0.65,1.14 0.45,1.43 0.28,1.73 0.15,2.06 0.06,2.39 0.01,2.74 0,3
GND on GND: 0.26,51.18 52.32,51.18 52.32,0.26 0.26,0.26
VBUS on Top Layer: 12.57,40.62 17,40.62 17,38.88 12.57,38.88
VBUS on Top Layer: 19.37,26.84 21.08,26.84 21.08,23.24 19.37,23.24
$1N9520 on Top Layer: 6.62,40.61 10.94,40.61 10.94,37.43 6.62,37.43

Small or netless copper shapes (teardrops, artwork), in the pictures only: 26 on GND

## Text on the board
Top Silkscreen Layer: CLK | +3.3V | RST | DIO | GND | BOOTSEL | TX2
